# EAGLE design RoboClaw_V2 Board (EAGLE 8.4.0)
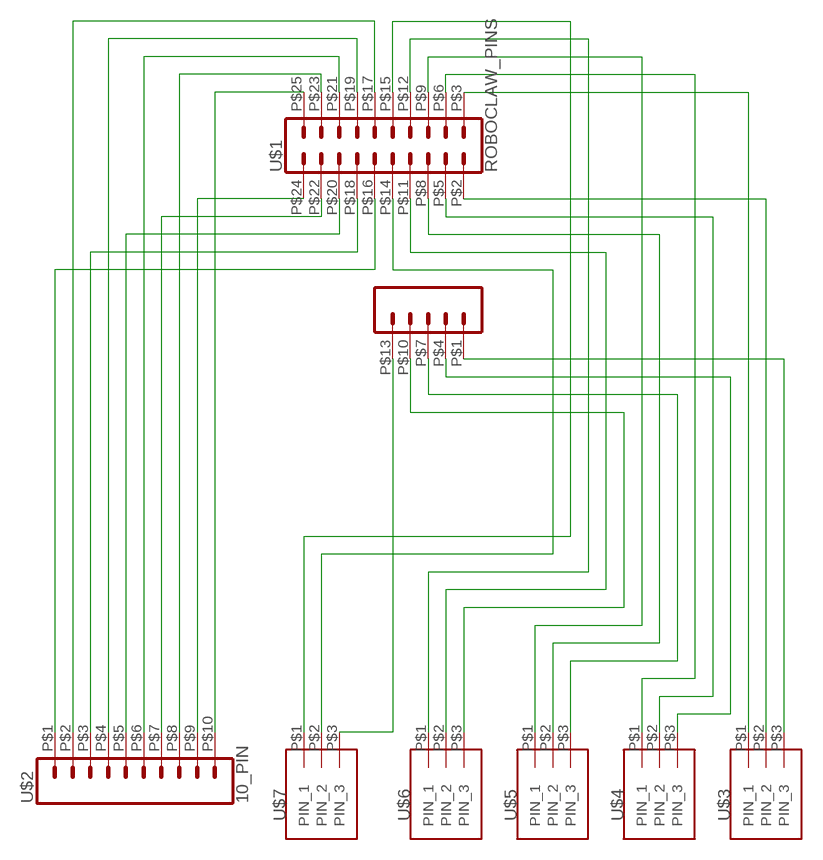
[diagram p0: schematic, sheet 1]

## Parts
U$1  ROBOCLAW_PINS  [ROBOCLAW_PINS]
U$2  10_PIN  [10_PIN]
U$3  3_PIN  [3_PIN]
U$4  3_PIN  [3_PIN]
U$5  3_PIN  [3_PIN]
U$6  3_PIN  [3_PIN]
U$7  3_PIN  [3_PIN]

## Nets
N$1: U$1.P$1(PIN_1) U$3.P$3(PIN_3)
N$2: U$1.P$2(PIN_2) U$3.P$2(PIN_2)
N$3: U$1.P$3(PIN_3) U$3.P$1(PIN_1)
N$4: U$1.P$6(PIN_6) U$4.P$1(PIN_1)
N$5: U$1.P$5(PIN_5) U$4.P$2(PIN_2)
N$6: U$1.P$4(PIN_4) U$4.P$3(PIN_3)
N$7: U$1.P$9(PIN_9) U$5.P$1(PIN_1)
N$8: U$1.P$8(PIN_8) U$5.P$2(PIN_2)
N$9: U$1.P$7(PIN_7) U$5.P$3(PIN_3)
N$10: U$1.P$12(PIN_12) U$6.P$1(PIN_1)
N$11: U$1.P$11(PIN_11) U$6.P$2(PIN_2)
N$12: U$1.P$10(PIN_10) U$6.P$3(PIN_3)
N$13: U$1.P$15(PIN_15) U$7.P$1(PIN_1)
N$14: U$1.P$14(PIN_14) U$7.P$2(PIN_2)
N$16: U$1.P$18(PIN_18) U$2.P$3(PIN_3)
N$17: U$1.P$21(PIN_21) U$2.P$6(PIN_6)
N$18: U$1.P$20(PIN_20) U$2.P$5(PIN_5)
N$19: U$1.P$23(PIN_23) U$2.P$8(PIN_8)
N$20: U$1.P$22(PIN_22) U$2.P$7(PIN_7)
N$21: U$1.P$24(PIN_24) U$2.P$9(PIN_9)
N$22: U$1.P$25(PIN_25) U$2.P$10(PIN_10)
N$24: U$1.P$17(PIN_17) U$2.P$2(PIN_2)
N$25: U$1.P$16(PIN_16) U$2.P$1(PIN_1)
N$26: U$1.P$19(PIN_19) U$2.P$4(PIN_4)
N$28: U$1.P$13(PIN_13) U$7.P$3(PIN_3)

## Library data of the parts
U$1 = Screw Blocks:ROBOCLAW_PINS
U$2 = Screw Blocks:10_PIN
U$3-U$7 = Screw Blocks:3_PIN

## Board
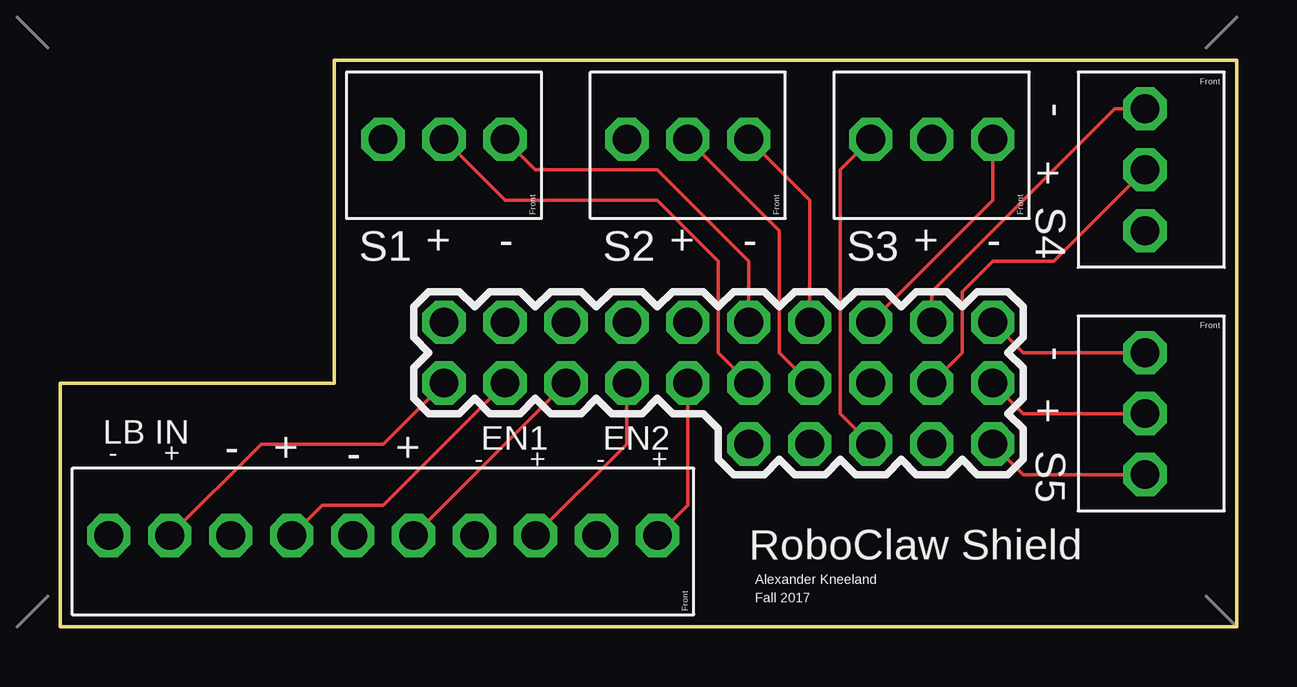
[diagram p1: board, top side]
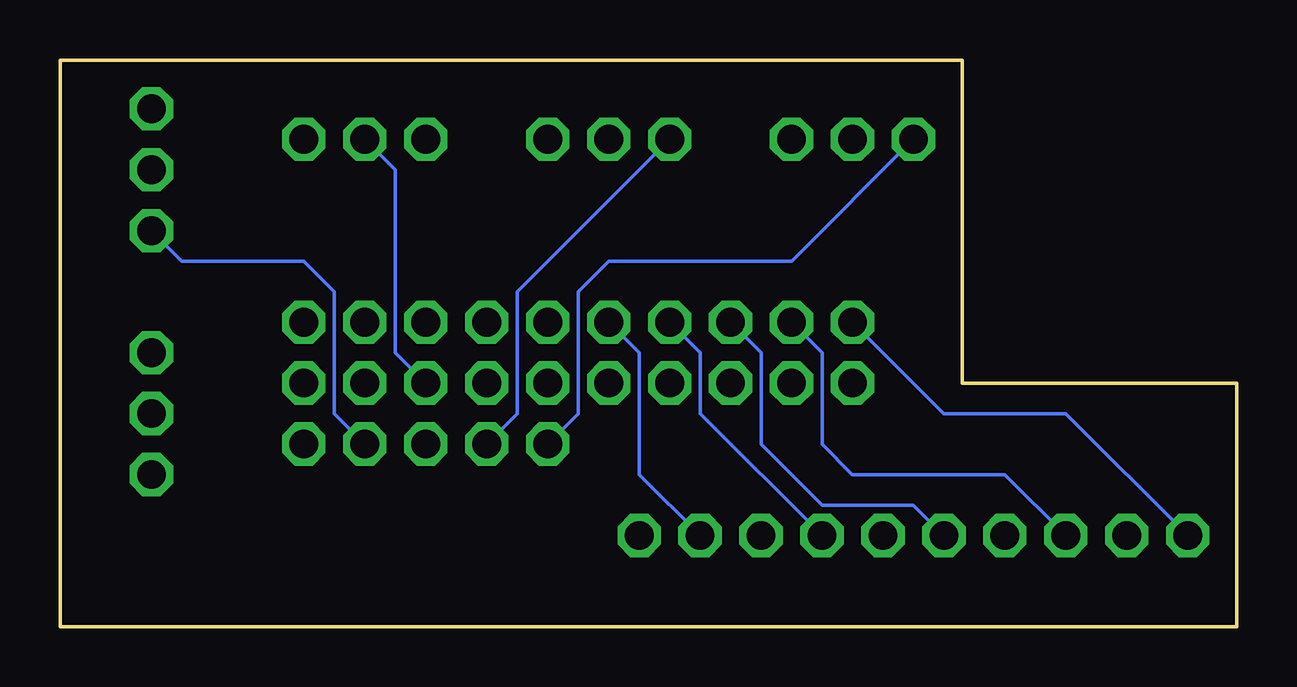
[diagram p2: board, bottom side, seen from below]

Size 49.02 x 23.62 mm. Coordinates in mm from the lower left corner, seen from the top.
Outline: 11.43,23.62 11.43,10.16 0,10.16 0,0 49.02,0 49.02,23.62 11.43,23.62
Copper layers (1*16): Top 0.035mm / dielectric 1.5mm / Bottom 0.035mm
Design rules "default": minimum track width 6mil, minimum drill 0.35mm, track to track 6mil, track to pad 6mil, pad to pad 6mil, via to via 6mil, smd to smd 6mil, copper to edge 40mil, drill to drill 6mil, minimum pad ring 10mil, minimum via ring 8mil, stop-mask expansion 4mil, vias tented up to drill 0mil, thermal gap 10mil

### Footprints (pad centres in the part's own frame; a part is rotated, then mirrored left to right if it is on the bottom)
ROBOCLAW_PINS = drill 1.2 pad 1.778 octagon: P$1 12.7,0; P$2 12.7,2.54; P$3 12.7,5.08; P$4 10.16,0; P$5 10.16,2.54; P$6 10.16,5.08; P$7 7.62,0; P$8 7.62,2.54; P$9 7.62,5.08; P$10 5.08,0; P$11 5.08,2.54; P$12 5.08,5.08; P$13 2.54,0; P$14 2.54,2.54; P$15 2.54,5.08; P$16 0,2.54; P$17 0,5.08; P$18 -2.54,2.54; P$19 -2.54,5.08; P$20 -5.08,2.54; P$21 -5.08,5.08; P$22 -7.62,2.54; P$23 -7.62,5.08; P$24 -10.16,2.54; P$25 -10.16,5.08
10_PIN = drill 1.2 pad 1.778 octagon: P$1 0,0; P$2 0,-2.54; P$3 0,-5.08; P$4 0,-7.62; P$5 0,-10.16; P$6 0,-12.7; P$7 0,-15.24; P$8 0,-17.78; P$9 0,-20.32; P$10 0,-22.86
3_PIN = drill 1.2 pad 1.778 octagon: P$1 1.27,11.43; P$2 1.27,8.89; P$3 1.27,6.35

### Placement (x,y rotation side)
U$1  26.16,7.62 0 top
U$2  24.89,3.81 270 top
U$3  43.94,0 0 top
U$4  43.94,10.16 0 top
U$5  27.43,21.59 270 top
U$6  17.27,21.59 270 top
U$7  7.11,21.59 270 top

### Tracks (layer width: path | path; a pad name or v marks a point on that pad's centre or on a via)
N$1
  Top 0.152: U$1.P$1 40.13,6.35 U$3.P$3
N$2
  Top 0.152: U$1.P$2 40.13,8.89 U$3.P$2
N$3
  Top 0.152: U$1.P$3 40.13,11.43 U$3.P$1
N$4
  Top 0.152: U$1.P$6 36.32,13.97 43.94,21.59 U$4.P$1
N$5
  Top 0.152: U$1.P$5 37.59,11.43 37.59,13.97 38.86,15.24 41.4,15.24 U$4.P$2
N$6
  Bottom 0.152: U$1.P$4 37.59,8.89 37.59,13.97 38.86,15.24 43.94,15.24 U$4.P$3
N$7
  Top 0.152: U$1.P$9 38.86,17.78 U$5.P$1
N$8
  Bottom 0.152: U$1.P$8 35.05,11.43 35.05,19.05 U$5.P$2
N$9
  Top 0.152: U$1.P$7 32.51,8.89 32.51,19.05 U$5.P$3
N$10
  Top 0.152: U$1.P$12 31.24,17.78 U$6.P$1
N$11
  Top 0.152: U$1.P$11 29.97,11.43 29.97,16.51 U$6.P$2
N$12
  Bottom 0.152: U$1.P$10 29.97,8.89 29.97,13.97 U$6.P$3
N$13
  Top 0.152: U$1.P$15 28.7,15.24 24.89,19.05 19.81,19.05 U$7.P$1
N$14
  Top 0.152: U$1.P$14 27.43,11.43 27.43,15.24 24.89,17.78 18.54,17.78 U$7.P$2
N$16
  Top 0.152: U$2.P$3 23.62,7.62 U$1.P$18
N$17
  Bottom 0.152: U$1.P$21 19.81,11.43 19.81,7.62 17.27,5.08 13.46,5.08 U$2.P$6
N$18
  Top 0.152: U$1.P$20 U$2.P$5
N$19
  Bottom 0.152: U$1.P$23 17.27,11.43 17.27,7.62 16,6.35 9.65,6.35 U$2.P$8
N$20
  Top 0.152: U$1.P$22 13.46,5.08 10.92,5.08 U$2.P$7
N$21
  Top 0.152: U$1.P$24 13.46,7.62 8.38,7.62 U$2.P$9
N$22
  Bottom 0.152: U$1.P$25 12.19,8.89 7.11,8.89 U$2.P$10
N$24
  Bottom 0.152: U$1.P$17 24.89,11.43 24.89,6.35 U$2.P$2
N$25
  Top 0.152: U$2.P$1 26.16,5.08 U$1.P$16
N$26
  Bottom 0.152: U$1.P$19 22.35,11.43 22.35,8.89 U$2.P$4
N$28
  Bottom 0.152: U$1.P$13 27.43,8.89 27.43,13.97 26.16,15.24 18.54,15.24 U$7.P$3

### Text on the board
tNames: - | + | S4 | S1 | + | - | S2 | + | - | S3 | + | - | - | + | LB IN | EN1 | EN2 | S5 | - | + | - | + | - | + | - | + | - | + | RoboClaw Shield | Alexander Kneeland | Fall 2017